# EAGLE design schem1 (EAGLE 5.11)
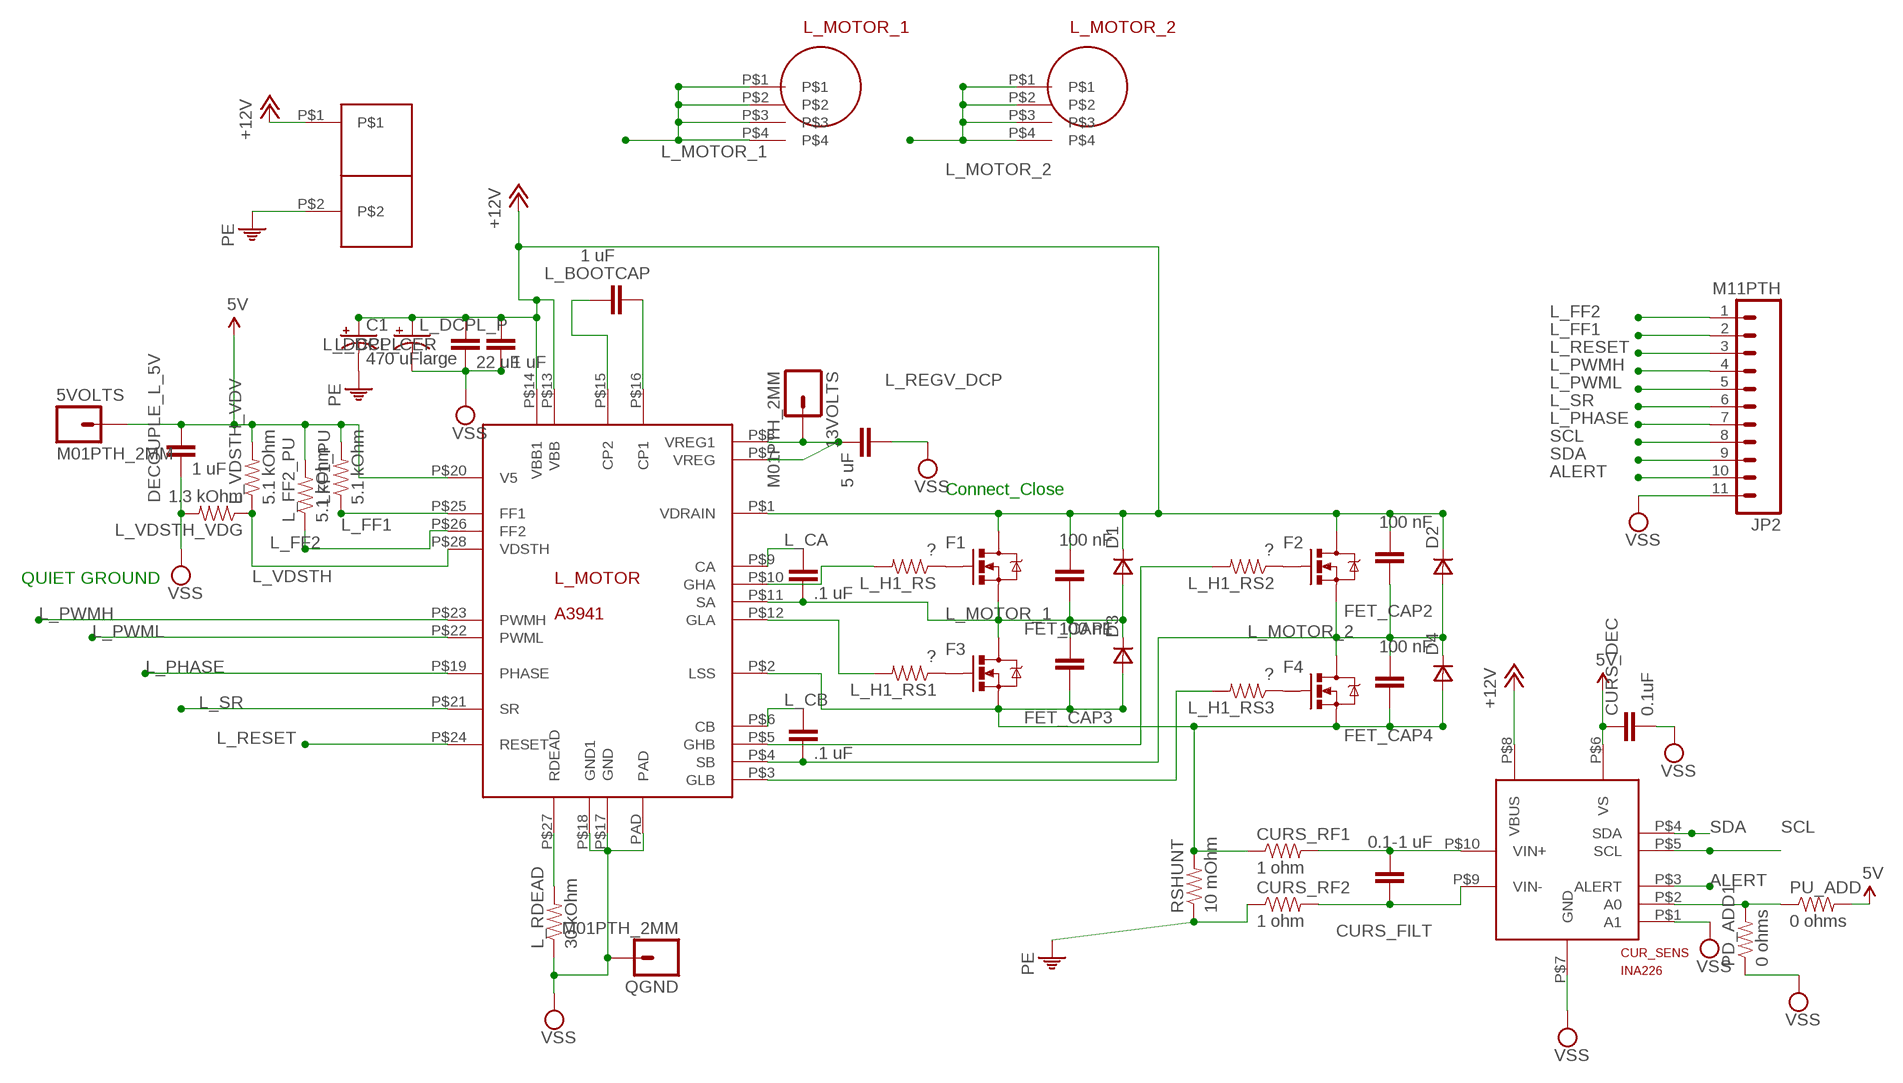
[diagram p0: schematic, sheet 1]

## Parts
5VOLTS  M01PTH_2MM  [1X01_2MM]
13VOLTS  M01PTH_2MM  [1X01_2MM]
C1  470 uF  CAP_POLPTH3  [CPOL-RADIAL-1000UF-63V]
CUR_SENS  INA226  [PSOP-10]
CURS_DEC  0.1uF  CAP0603-CAP  [0603-CAP]
CURS_FILT  0.1-1 uF  CAP0603-CAP  [0603-CAP]
CURS_RF1  1 ohm  RESISTOR0603-RES  [0603-RES]
CURS_RF2  1 ohm  RESISTOR0603-RES  [0603-RES]
D1  DSOT23  [SOT-23]
D2  DSOT23  [SOT-23]
D3  DSOT23  [SOT-23]
D4  DSOT23  [SOT-23]
DECOUPLE_L_5V  1 uF  CAP1206  [1206]
F1  MOSFET-NCHANNELPTH2  [TO220V]
F2  MOSFET-NCHANNELPTH2  [TO220V]
F3  MOSFET-NCHANNELPTH2  [TO220V]
F4  MOSFET-NCHANNELPTH2  [TO220V]
FET_CAP1  100 nF  CAP0603-CAP  [0603-CAP]
FET_CAP2  100 nF  CAP0603-CAP  [0603-CAP]
FET_CAP3  100 nF  CAP0603-CAP  [0603-CAP]
FET_CAP4  100 nF  CAP0603-CAP  [0603-CAP]
JP2  M11PTH  [1X11]
L_BOOTCAP  1 uF  CAP1206  [1206]
L_CA  .1 uF  CAP1206  [1206]
L_CB  .1 uF  CAP1206  [1206]
L_DCPL  22 uF  CAP1206  [1206]
L_DCPL_CER  1 uF  CAP1206  [1206]
L_DCPL_P  large  CAP_POLPTH1  [CPOL-RADIAL-100UF-25V]
L_FF2_PU  5.1 kOhm  RESISTOR0805-RES  [0805]
L_H1_RS  ?  RESISTOR0805-RES  [0805]
L_H1_RS1  ?  RESISTOR0805-RES  [0805]
L_H1_RS2  ?  RESISTOR0805-RES  [0805]
L_H1_RS3  ?  RESISTOR0805-RES  [0805]
L_MOTOR  A3941  [TSSOP28_EXPOSED]
L_MOTOR_1  SCREW_TERMINAL  [SCREW_TERMINAL_7693]
L_MOTOR_2  SCREW_TERMINAL  [SCREW_TERMINAL_7693]
L_RDEAD  30 kOhm  RESISTOR0805-RES  [0805]
L_REGV_DCP  5 uF  CAP1206  [1206]
L_VDSTH_VDG  1.3 kOhm  RESISTOR0805-RES  [0805]
L_VDSTH_VDV  5.1 kOhm  RESISTOR0805-RES  [0805]
LFF1_PU  5.1 kOhm  RESISTOR0805-RES  [0805]
PD_ADD1  0 ohms  RESISTOR0603-RES  [0603-RES]
PU_ADD  0 ohms  RESISTOR0603-RES  [0603-RES]
QGND  M01PTH_2MM  [1X01_2MM]
RSHUNT  10 mOhm  RESISTOR1206  [1206]
U$4  PLUG_TERM_2  [TERM_BLOCK_2]

## Nets
5V: 5VOLTS.1 CUR_SENS.P$6(VS) CURS_DEC.1 DECOUPLE_L_5V.1 L_FF2_PU.2 L_MOTOR.P$20(V5) L_VDSTH_VDV.2 LFF1_PU.2 PU_ADD.2
+12V: C1.1(+) CUR_SENS.P$8(VBUS) D1.1(C) D2.1(C) F1.2(D) F2.2(D) FET_CAP1.2 FET_CAP2.2 L_DCPL.1 L_DCPL_CER.1 L_DCPL_P.1(+) L_MOTOR.P$1(VDRAIN) L_MOTOR.P$13(VBB) L_MOTOR.P$14(VBB1) U$4.P$1
ALERT: CUR_SENS.P$3(ALERT) JP2.10
L_FF1: JP2.2 L_MOTOR.P$25(FF1) LFF1_PU.1
L_FF2: JP2.1 L_FF2_PU.1 L_MOTOR.P$26(FF2)
L_MOTOR_1: D1.3(A) D3.1(C) F1.3(S) F3.2(D) FET_CAP1.1 FET_CAP3.2 L_CA.2 L_MOTOR.P$11(SA) L_MOTOR_1.P$1 L_MOTOR_1.P$2 L_MOTOR_1.P$3 L_MOTOR_1.P$4
L_MOTOR_2: D2.3(A) D4.1(C) F2.3(S) F4.2(D) FET_CAP2.1 FET_CAP4.2 L_CB.2 L_MOTOR.P$4(SB) L_MOTOR_2.P$1 L_MOTOR_2.P$2 L_MOTOR_2.P$3 L_MOTOR_2.P$4
L_PHASE: JP2.7 L_MOTOR.P$19(PHASE)
L_PWMH: JP2.4 L_MOTOR.P$23(PWMH)
L_PWML: JP2.5 L_MOTOR.P$22(PWML)
L_RESET: JP2.3 L_MOTOR.P$24(RESET)
L_SR: JP2.6 L_MOTOR.P$21(SR)
L_VDSTH: L_MOTOR.P$28(VDSTH) L_VDSTH_VDG.1 L_VDSTH_VDV.1
N$1: L_BOOTCAP.2 L_MOTOR.P$16(CP1)
N$2: L_MOTOR.P$27(RDEAD) L_RDEAD.2
N$3: L_BOOTCAP.1 L_MOTOR.P$15(CP2)
N$4: 13VOLTS.1 L_MOTOR.P$7(VREG) L_MOTOR.P$8(VREG1) L_REGV_DCP.2
N$5: F1.1(G) L_H1_RS.1
N$6: F3.1(G) L_H1_RS1.1
N$7: F2.1(G) L_H1_RS2.1
N$8: F4.1(G) L_H1_RS3.1
N$9: L_H1_RS.2 L_MOTOR.P$10(GHA)
N$10: L_H1_RS1.2 L_MOTOR.P$12(GLA)
N$11: L_H1_RS2.2 L_MOTOR.P$5(GHB)
N$12: L_H1_RS3.2 L_MOTOR.P$3(GLB)
N$13: L_CB.1 L_MOTOR.P$6(CB)
N$14: CUR_SENS.P$10(VIN+) CURS_FILT.2 CURS_RF1.2
N$15: CURS_RF1.1 D3.3(A) D4.3(A) F3.3(S) F4.3(S) FET_CAP3.1 FET_CAP4.1 L_MOTOR.P$2(LSS) RSHUNT.2
N$16: L_CA.1 L_MOTOR.P$9(CA)
N$17: CUR_SENS.P$9(VIN-) CURS_FILT.1 CURS_RF2.2
N$21: CUR_SENS.P$2(A0) PD_ADD1.2 PU_ADD.1
PE: C1.2(-) CURS_RF2.1 RSHUNT.1 U$4.P$2
SCL: CUR_SENS.P$5(SCL) JP2.8
SDA: CUR_SENS.P$4(SDA) JP2.9
VSS: CUR_SENS.P$1(A1) CUR_SENS.P$7(GND) CURS_DEC.2 DECOUPLE_L_5V.2 JP2.11 L_DCPL.2 L_DCPL_CER.2 L_DCPL_P.2(-) L_MOTOR.P$17(GND) L_MOTOR.P$18(GND1) L_MOTOR.PAD L_RDEAD.1 L_REGV_DCP.1 L_VDSTH_VDG.2 PD_ADD1.1 QGND.1

## Notes on the sheet
- Connect_Close
- QUIET GROUND

## Library data of the parts
5VOLTS 13VOLTS QGND = SparkFun:M01: Header 1 Standard 1-pin 0.1" header. Use with straight break away headers (SKU : PRT-00116), right angle break away headers (PRT-00553), swiss pins (PRT-00743), machine pins (PRT-00117), and female headers (PRT-00115).
C1 L_DCPL_P = SparkFun:CAP_POL: Capacitor Polarized These are standard SMD and PTH capacitors. Normally 10uF, 47uF, and 100uF in electrolytic and tantalum varieties. Always verify the external diameter of the through hole cap, it varies with capacity, voltage, and manufacturer. The EIA devices should be standard.
CUR_SENS = chlk_bot:INA226
CURS_DEC CURS_FILT DECOUPLE_L_5V FET_CAP1-FET_CAP4 L_BOOTCAP L_CA L_CB L_DCPL L_DCPL_CER L_REGV_DCP = SparkFun:CAP: Capacitor Standard 0603 ceramic capacitor, and 0.1" leaded capacitor.
CURS_RF1 CURS_RF2 L_FF2_PU L_H1_RS L_H1_RS1-L_H1_RS3 L_RDEAD L_VDSTH_VDG L_VDSTH_VDV LFF1_PU PD_ADD1 PU_ADD RSHUNT = SparkFun:RESISTOR: Resistor Basic schematic elements and footprints for 0603, 1206, and PTH resistors.
D1-D4 = zetex:D: DIODE; MPN: CDSOT23-T03; OC_FARNELL: 1824866; OC_NEWARK: 75K7096
F1-F4 = SparkFun:MOSFET-NCHANNEL
JP2 = SparkFun:M11: Header 11 Standard 11-pin 0.1" header. Use with straight break away headers (SKU : PRT-00116), right angle break away headers (PRT-00553), swiss pins (PRT-00743), machine pins (PRT-00117), and female headers (PRT-00115).
L_MOTOR = chlk_bot:A3941
L_MOTOR_1 L_MOTOR_2 = chlk_bot:SCREW_TERMINAL
U$4 = chlk_bot:PLUG_TERM_2

## Board
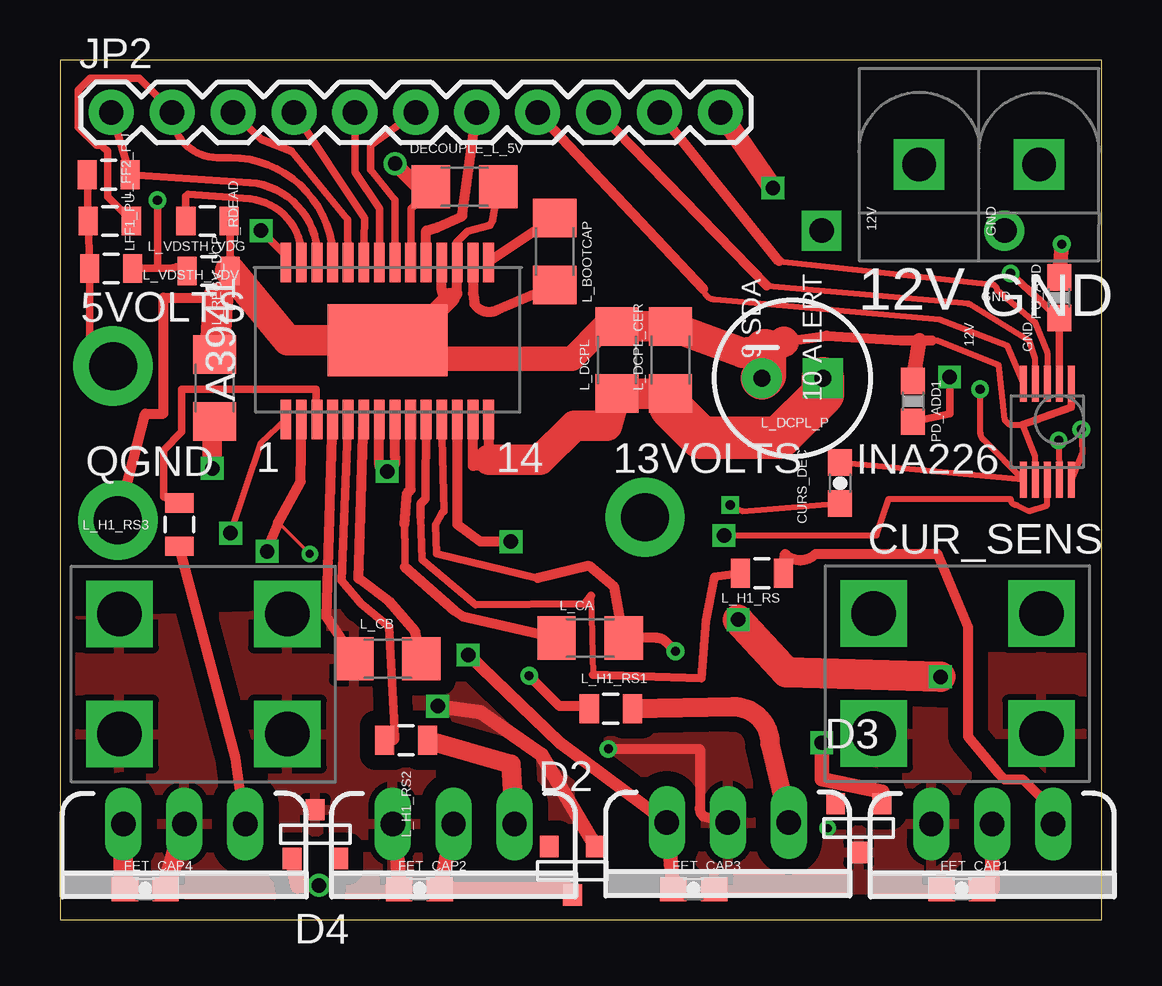
[diagram p1: board, top side]
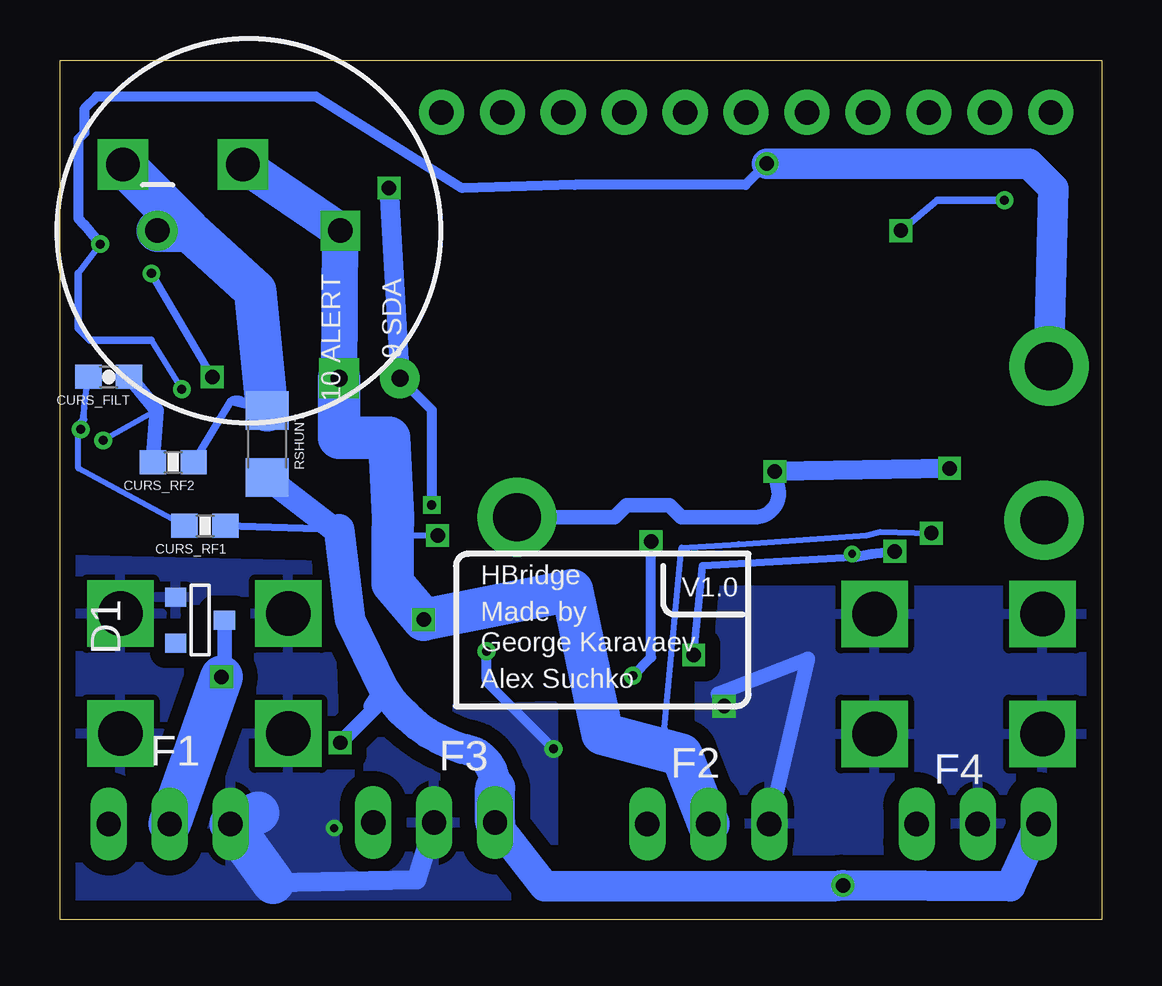
[diagram p2: board, bottom side, seen from below]

Size 43.43 x 35.81 mm. Coordinates in mm from the lower left corner, seen from the top.
Outline: 0,0 43.43,0 43.43,35.81 0,35.81 0,0
Copper layers (1*16): Top 0.0356mm / dielectric 1.5011mm / Bottom 0.0356mm
Design rules "LaenPCBOrder *": minimum track width 6mil, minimum drill 13mil, track to track 7mil, track to pad 7mil, pad to pad 7mil, via to via 7mil, smd to smd 7mil, copper to edge 15mil, drill to drill 6mil, minimum pad ring 7mil, minimum via ring 7mil, stop-mask expansion 4mil, vias tented up to drill 0mil, thermal gap 10mil

### Footprints (pad centres in the part's own frame; a part is rotated, then mirrored left to right if it is on the bottom)
1X01_2MM = drill 2 pad 3.302 round: 1 0,0
CPOL-RADIAL-1000UF-63V = drill 1.016 pad 1.651 square: 1 3.81,0 | drill 1.016 pad 1.676 round: 2 -3.81,0
PSOP-10 = smd 0.3 x 1.5: P$1 -0.5,-1.5; P$2 0,-1.5; P$3 0.5,-1.5; P$4 1,-1.5; P$5 1.5,-1.5; P$6 1.5,2.5; P$7 1,2.5; P$8 0.5,2.5; P$9 0,2.5; P$10 -0.5,2.5
0603-CAP = smd 1.1 x 1: 1 -0.85,0; 2 0.85,0
0603-RES = smd 1.1 x 1: 1 -0.85,0; 2 0.85,0
SOT-23 = smd 0.787 x 0.889: 1 0.025,-1.016; 2 -0.94,1.016; 3 0.991,1.016
1206 = smd 1.6 x 1.8: 1 -1.4,0; 2 1.4,0
TO220V = drill 1.016 long: 1 -2.54,0; 2 0,0; 3 2.54,0
1X11 = drill 1.016 pad 1.88 round: 1 0,0; 2 2.54,0; 3 5.08,0; 4 7.62,0; 5 10.16,0; 6 12.7,0; 7 15.24,0; 8 17.78,0; 9 20.32,0; 10 22.86,0; 11 25.4,0
CPOL-RADIAL-100UF-25V = drill 0.7 pad 1.651 square: 1 1.27,0 | drill 0.7 pad 1.651 round: 2 -1.27,0
0805 = smd 0.8 x 1.2: 1 -0.9,0; 2 0.9,0
TSSOP28_EXPOSED = smd 0.45 x 1.65: P$1 -4.25,-3.3; P$2 -3.6,-3.3; P$3 -2.95,-3.3; P$4 -2.3,-3.3; P$5 -1.65,-3.3; P$6 -1,-3.3; P$7 -0.35,-3.3; P$8 0.3,-3.3; P$9 0.95,-3.3; P$10 1.6,-3.3; P$11 2.25,-3.3; P$12 2.9,-3.3; P$13 3.55,-3.3; P$14 4.2,-3.3; P$15 4.2,3.25; P$16 3.55,3.25; P$17 2.9,3.25; P$18 2.25,3.25; P$19 1.6,3.25; P$20 0.95,3.25; P$21 0.3,3.25; P$22 -0.35,3.25; P$23 -1,3.25; P$24 -1.65,3.25; P$25 -2.3,3.25; P$26 -2.95,3.25; P$27 -3.6,3.25; P$28 -4.25,3.25 | smd 5 x 3: PAD 0,0
SCREW_TERMINAL_7693 = drill 1.85 square: P$1 -3,2; P$2 -3,-3; P$3 4,-3; P$4 4,2
TERM_BLOCK_2 = drill 1.4 square: P$1 -2.5,0; P$2 2.5,0

### Placement (x,y rotation side)
5VOLTS  2.21,23.06 0 top
13VOLTS  24.38,16.76 0 top
C1  35.56,28.7 0 bottom
CUR_SENS  41.66,20.83 180 top
CURS_DEC  32.51,18.19 270 top
CURS_FILT  41.4,22.61 180 bottom
CURS_RF1  37.39,16.41 180 bottom
CURS_RF2  38.71,19.05 180 bottom
D1  37.59,12.45 90 bottom
D2  21.34,2.03 0 top
D3  33.27,3.81 0 top
D4  10.67,3.56 180 top
DECOUPLE_L_5V  16.87,30.53 0 top
F1  38.86,3.99 180 top
F2  16.41,3.99 180 top
F3  27.84,4.04 180 top
F4  5.18,3.99 180 top
FET_CAP1  37.59,1.27 0 top
FET_CAP2  14.99,1.27 0 top
FET_CAP3  26.42,1.27 0 top
FET_CAP4  3.56,1.27 0 top
JP2  2.13,33.63 0 top
L_BOOTCAP  20.62,27.84 270 top
L_CA  22.1,11.73 0 top
L_CB  13.67,10.87 180 top
L_DCPL  23.22,23.32 90 top
L_DCPL_CER  25.45,23.32 90 top
L_DCPL_P  30.53,22.56 0 top
L_FF2_PU  2.03,31.04 180 top
L_H1_RS  29.26,14.43 180 top
L_H1_RS1  22.96,8.79 180 top
L_H1_RS2  14.43,7.47 180 top
L_H1_RS3  4.98,16.46 90 top
L_MOTOR  13.67,24.13 0 top
L_MOTOR_1  37.92,9.75 180 top
L_MOTOR_2  5.48,10.73 0 top
L_RDEAD  6.15,29.11 180 top
L_REGV_DCP  6.45,22.15 270 top
L_VDSTH_VDG  6.2,27.03 0 top
L_VDSTH_VDV  2.13,27.13 180 top
LFF1_PU  2.08,29.11 180 top
PD_ADD1  35.56,21.59 270 top
PU_ADD  41.66,25.91 90 top
QGND  2.41,16.64 0 top
RSHUNT  34.8,19.81 270 bottom
U$4  38.3,31.45 0 top

### Tracks (layer width: path | path; a pad name or v marks a point on that pad's centre or on a via)
5V  (via drill 0.38, 0.6)
  Top 0.254: CURS_DEC.1 CUR_SENS.P$6 38.5,19.98 arc-45 38.35,20.34 v38.35,22.1
  Top 0.305: L_FF2_PU.2 LFF1_PU.2 L_VDSTH_VDV.2 1.23,23.91 arc90 5VOLTS.1 | L_MOTOR.P$20 14.63,27.38 14.63,29.62 DECOUPLE_L_5V.1
  Top 0.61: DECOUPLE_L_5V.1 14.93,30.53 v13.97,31.5 | v41.76,28.14 PU_ADD.2
  Bottom 0.254: 39.62,24.13 v38.35,22.1 | v41.76,28.14 42.67,26.92
  Bottom 0.305: 39.62,24.13 42.16,24.13 42.67,24.64 42.67,26.92
  Bottom 0.406: v41.76,28.14 42.42,28.96 42.67,29.21 42.67,32.51 42.42,32.77 42.42,33.78 41.91,34.29 32.77,34.29 26.67,30.48 21.97,30.61 14.86,30.61 v13.97,31.5
  Bottom 1.27: v13.97,31.5 3.05,31.5 2.03,30.48 5VOLTS.1
+12V  (via drill 0.6)
  Top 0.254: L_MOTOR.P$1 8.38,19.86 v7.11,16.1 | CUR_SENS.P$8 41.15,17.27 40.39,17.02 39.88,17.27 arc-90 39.62,17.53 34.54,17.53 34.04,16 v27.69,16
  Top 0.406: L_MOTOR.P$13 17.21,18.9 arc90 17.22,18.9 17.63,18.9 arc90 17.88,19.15 17.88,20.81 arc90 L_MOTOR.P$14
  Top 0.61: F2.2 FET_CAP2.2 21.11,1.27 arc-90 D2.1 | FET_CAP1.2 38.86,1.27 F1.2
  Top 0.813: 25.45,21.34 L_DCPL_CER.1 | L_DCPL.1 23.06,21.56
  Top 1.27: v28.27,12.5 30.29,10.3 v36.7,10.11 | L_DCPL_CER.1 L_DCPL.1 | 23.06,21.56 22.81,20.57 21.44,20.57 20.02,19.15 17.88,19.15
  Top 1.778: 25.45,21.34 26.72,20.07 29.97,20.07 31.8,21.89 L_DCPL_P.1
  Bottom 0.254: v7.11,16.1 9.25,16.15 9.8,16 15.14,15.65 17.53,15.49 18.24,8 17.42,6.58 17.42,6.57 17.41,6.56 | 29.56,16.77 30.32,16.76 | 29.57,16 v27.69,16
  Bottom 0.61: v36.7,10.11 36.58,10.11 D1.1
  Bottom 0.813: 17.41,6.56 17.53,6.86
  Bottom 1.524: U$4.P$1 C1.1 L_DCPL_P.1
  Bottom 1.778: v36.7,10.11 F1.2 | F2.2 17.41,6.56 | 17.53,6.86 20.83,7.75 22.1,13.72 v28.27,12.5 29.57,14.02 29.57,16 29.56,16.77 29.72,20.07 31.8,20.07 L_DCPL_P.1
ALERT
  Top 0.254: CUR_SENS.P$3 41.15,23.62 40.64,24.89 39.06,26.21 arc90 38.81,26.47 29.97,27.43
  Top 0.406: 29.97,27.43 JP2.10
L_FF1
  Top 0.305: LFF1_PU.1 1.98,30.11 1.98,32 1.78,32.21 1.78,32.26 1.52,32.26 0.76,33.02 0.76,34.54 1.27,35.05 3.3,35.05 4.67,33.68 JP2.2 arc90 6.55,31.75 7.11,31.75 arc-90 11.39,27.42
  Top 0.406: 11.39,27.42 L_MOTOR.P$25
L_FF2
  Top 0.305: JP2.1 L_FF2_PU.1 7.92,30.71 arc-90 L_MOTOR.P$26
L_MOTOR_1  (via drill 0.33, 0.38)
  Top 0.152: v32,3.81 31.98,3.54
  Top 0.305: 19.91,14.22 15.7,15.24 15.66,16.44 15.94,16.95 16,17.02 L_MOTOR.P$11
  Top 0.406: 19.91,14.22 22.05,14.73 23.11,13.85 L_CA.2 24.89,11.73 arc-45 25.24,11.59 v25.65,11.18 | v22.86,7.11 26.67,7.11 26.67,4.66 arc45 26.82,4.3 F3.2
  Bottom 0.406: v25.65,11.18 25.65,10.12 arc-45 25.51,9.76 v22.86,7.11
  Bottom 0.813: 34.54,1.52 28.58,1.65 F3.2
  Bottom 1.778: 35.18,4.45 F1.3 34.54,1.52
  pour Top (isolate 0.635): 22.86,7.62 22.86,1.27 42.67,1.27 42.67,10.92 34.54,10.92 34.54,7.62
  pour Bottom (isolate 0.635): 22.86,8.89 32,8.64 32.26,14.73 43.18,14.99 42.93,1.02 22.86,1.02
L_MOTOR_2  (via drill 0.6)
  Top 0.152: 9.17,12.53 9.14,12.7 L_MOTOR_2.P$4 | 13.99,3.8 14.22,3.81 F2.3
  Top 0.406: L_CB.2 11.11,12.6 L_MOTOR.P$4
  Top 0.61: FET_CAP2.1 13.99,3.8 13.97,4.06 | D2.3 20.07,6.86 17.53,8.64 v15.75,8.89
  Top 0.813: FET_CAP4.2 F4.2
  Bottom 0.61: v15.75,8.89 16,9.4 L_CB.2 F2.3
  pour Top (isolate 0.635): 0.51,12.45 18.29,12.95 21.08,12.95 21.34,1.02 0.76,1.02
  pour Bottom (isolate 0.635): 21.08,1.27 21.08,6.86 16.76,6.86 16.76,13.72 0.76,13.72 0.76,1.02 21.08,1.02
L_PHASE
  Top 0.406: L_MOTOR.P$19 15.26,28.7 15.75,28.85 16.76,29.31 JP2.7
L_PWMH
  Top 0.305: L_MOTOR.P$23 12.7,29.21 JP2.4
L_PWML
  Top 0.305: L_MOTOR.P$22 13.31,29.61 12.29,31.14 JP2.5
L_RESET
  Top 0.305: L_MOTOR.P$24 11.99,29.16 9.65,32 8.38,32.51 JP2.3
L_SR
  Top 0.305: L_MOTOR.P$21 13.96,29.98 12.95,31.24 12.95,32.26 JP2.6
L_VDSTH  (via drill 0.38, 0.6)
  Top 0.305: 4.06,27.13 4.69,27.13 arc-90 L_VDSTH_VDG.1 | 4.06,27.13 L_VDSTH_VDV.1 | L_MOTOR.P$28 9.41,27.67 v8.38,28.7 | 4.06,27.13 v4.06,29.97
  Bottom 0.305: v8.38,28.7 6.86,29.97 v4.06,29.97
N$1
  Top 0.406: L_BOOTCAP.2 18.27,25.42 arc-90 17.27,25.65 arc13 17.22,26.09 17.21,26.09 L_MOTOR.P$16
N$2
  Top 0.305: L_RDEAD.2 5.25,30.14 5.33,30.23 7.93,30.02 arc-90 L_MOTOR.P$27
N$3
  Top 0.406: L_MOTOR.P$15 arc-90 17.95,27.46 L_BOOTCAP.1
N$4  (via drill 0.6)
  Top 0.406: L_MOTOR.P$8 13.96,19.3 arc-90 v13.64,18.67 arc-90 13.31,18.95 L_MOTOR.P$7 arc-90 L_MOTOR.P$7
  Top 0.813: L_REGV_DCP.2 arc90 6.35,20.65 v6.35,18.8
  Bottom 0.61: 13VOLTS.1 20.32,16.76 19.81,17.27 18.03,17.27 17.53,16.76 14.48,16.76 arc-90 13.46,17.78 v13.64,18.67
  Bottom 0.813: v6.35,18.8 v13.64,18.67
N$5
  Top 0.406: F1.1 41.4,4.57 40.13,5.84 39.37,5.84 39.12,6.1 37.85,7.62 37.85,12.19 36.58,15.24 31.5,15.24 arc-90 30.23,15.24 L_H1_RS.1
N$6
  Top 0.813: F3.1 29.6,7.34 arc91 28.05,8.86 L_H1_RS1.1
N$7
  Top 0.813: L_H1_RS2.1 18.8,6.48 F2.1
N$8
  Top 0.406: L_H1_RS3.1 7.32,6.72 7.57,4.9 F4.1
N$9
  Top 0.254: 22.14,13.48 22.21,10.21
  Top 0.305: 15.04,16.76 15.09,14.99 17.32,13.11 21.89,13.16
  Top 0.356: 15.04,16.76 15.04,17.32 15.24,17.53 L_MOTOR.P$10 | 21.89,13.16 22.14,13.48 | 22.21,10.21 26.75,10.06 26.92,12.45 27.28,14.28 L_H1_RS.2
N$10  (via drill 0.38, 0.6)
  Top 0.406: L_MOTOR.P$12 16.57,16.45 17.53,15.75 v18.8,15.75 | v19.56,10.16 20.83,8.89 21.96,8.89 L_H1_RS1.2
  Bottom 0.406: v18.8,15.75 18.8,10.92 v19.56,10.16
N$11
  Top 0.356: L_MOTOR.P$5 11.73,14.12 12.55,13.16 13.72,12.19 13.97,7.57 arc-90 13.82,7.42 L_H1_RS2.2
N$12
  Top 0.305: L_MOTOR.P$3 10.67,20.88 10.67,22.1 5.08,22.1 5.08,20.32 4.32,19.56 4.32,17.61 L_H1_RS3.2
N$13
  Top 0.406: L_CB.1 14.81,12.01 13.72,13.26 12.45,14.21 L_MOTOR.P$6
N$14  (via drill 0.38)
  Top 0.254: CUR_SENS.P$10 42.62,19.46 v42.57,20.42
  Bottom 0.254: CURS_RF1.2 42.67,18.8 42.67,20.32 arc90 42.42,20.83 42.42,21.34 | 42.42,21.34 CURS_FILT.2 | 42.42,21.34 v42.57,20.42
N$15  (via drill 0.33, 0.6)
  Top 0.152: v10.41,15.24 9.14,16.51 9.09,16.53
  Top 0.406: L_MOTOR.P$2 10.04,18.24 9.09,16.53 8.64,15.44
  Top 0.508: v17.02,11.02 20.83,7.37 F3.3
  Top 0.61: F3.3 FET_CAP3.1 | D3.3 34.29,5.33 31.75,5.84 v31.75,7.37 | D4.3 9.91,1.4 v10.79,1.42
  Top 0.813: FET_CAP4.1 2.64,1.27 F4.3
  Bottom 0.152: 10.36,15.09 v10.41,15.24
  Bottom 0.305: v17.02,11.02 16.66,14.73 10.36,15.09 | 31.34,12.5 32,16.26 CURS_RF1.1
  Bottom 0.406: v8.64,15.34 9.6,15.24 10.36,15.09
  Bottom 0.61: v31.75,7.37 30.23,8.89 30.48,8.89 29.97,9.65
  Bottom 1.016: 32,16.26 RSHUNT.2
  Bottom 1.27: F4.3 3.81,1.4 v10.79,1.42 11.18,1.4 23.24,1.4 F3.3 | 25.3,5.49 arc-90 26.67,7.11 arc39 29.97,9.65 31.34,12.5 31.8,16.26
  Bottom 1.676: F3.3 25.3,5.49
N$16
  Top 0.305: 14.36,16.47 14.38,15.29 14.38,14.68
  Top 0.406: 14.36,16.47 14.48,17.78 14.62,17.92 L_MOTOR.P$9 | 14.38,14.68 16.46,12.85 16.79,12.63 L_CA.1
N$17  (via drill 0.38)
  Top 0.254: v41.63,19.96 CUR_SENS.P$9
  Bottom 0.254: 39.39,21.22 v41.63,19.96
  Bottom 0.61: CURS_RF2.2 39.39,21.22 CURS_FILT.1
N$21  (via drill 0.38, 0.6)
  Top 0.305: CUR_SENS.P$2 PU_ADD.1 v39.62,26.92 | PD_ADD1.2 37.08,21.08 v37.08,22.61
  Bottom 0.305: v37.08,22.61 v39.62,26.92
PE
  Bottom 0.305: 36.32,21.59 arc90 35.68,21.47 | 36.32,21.59 CURS_RF2.1 | RSHUNT.1 36.32,21.59
  Bottom 1.778: RSHUNT.1 35.31,26.21 38.05,28.7 | 38.05,28.7 U$4.P$2 | 38.05,28.7 C1.2
SCL
  Top 0.254: CUR_SENS.P$5 39.47,23.93 36.65,25 27.29,25.84 arc-79 26.82,26.27
  Top 0.406: JP2.8 26.82,26.27
SDA
  Top 0.254: 29.46,26.42 37.88,25.67 | 37.88,25.67 37.85,25.65 | CUR_SENS.P$4 40.64,23.37 40.39,24.13 37.88,25.67
  Top 0.406: JP2.9 29.46,26.42
VSS  (via drill 0.38, 0.6)
  Top 0.254: CUR_SENS.P$7 40.64,19.3 40.11,20.62 39.58,20.62 39.37,20.83 39.12,23.11 36.58,24.13 36.36,24.13 | CURS_DEC.2 28.45,17.02 v27.94,17.27
  Top 0.305: L_VDSTH_VDG.2 7.1,29.06 L_RDEAD.1 | 16.56,28.07 16.54,28.22 16.99,28.68 17.93,28.93 18.03,29.11 DECOUPLE_L_5V.2 | CUR_SENS.P$1 42.16,21.34 40.11,20.62
  Top 0.406: 30.18,24.08 31.95,24.33 35.05,24.13 35.81,24.13 36.36,24.13 | L_DCPL.2 23.5,24.64 | L_VDSTH_VDG.2 6.59,25.91 4.32,25.91 4.32,21.08 3.56,21.08 QGND.1 | 16.56,28.07 L_MOTOR.P$17 arc90 L_MOTOR.P$17 16.56,26.11 arc-90 16.36,25.91 16.26,25.91 arc-90 15.91,26.25 L_MOTOR.P$18
  Top 0.61: 35.81,24.13 PD_ADD1.1
  Top 0.813: L_MOTOR.PAD 14.48,24.13 16.26,25.91 | v29.72,30.48 JP2.11
  Top 1.016: L_DCPL.2 22.69,24.72 21.34,23.37 14.43,23.37 L_MOTOR.PAD
  Top 1.27: 30.18,24.08 29.59,23.75 29.39,23.73 28.45,23.62 L_DCPL_CER.2 L_DCPL.2 | 14.25,23.55 L_MOTOR.PAD 9.48,24.13 L_VDSTH_VDG.2 | 6.59,25.91 L_REGV_DCP.1
  Top 1.778: L_DCPL_P.2 29.39,22.69 29.39,23.73
  Bottom 0.406: L_DCPL_P.2 27.94,21.23 v27.94,17.27
  Bottom 0.813: L_DCPL_P.2 v29.72,30.48

### Text on the board
tNames: GND | 12V | GND | 12V | GND | GND | 12V | 9 SDA | 10 ALERT
bNames: 9 SDA | 10 ALERT | HBridge | V1.0 | Made by | George Karavaev | Alex Suchko